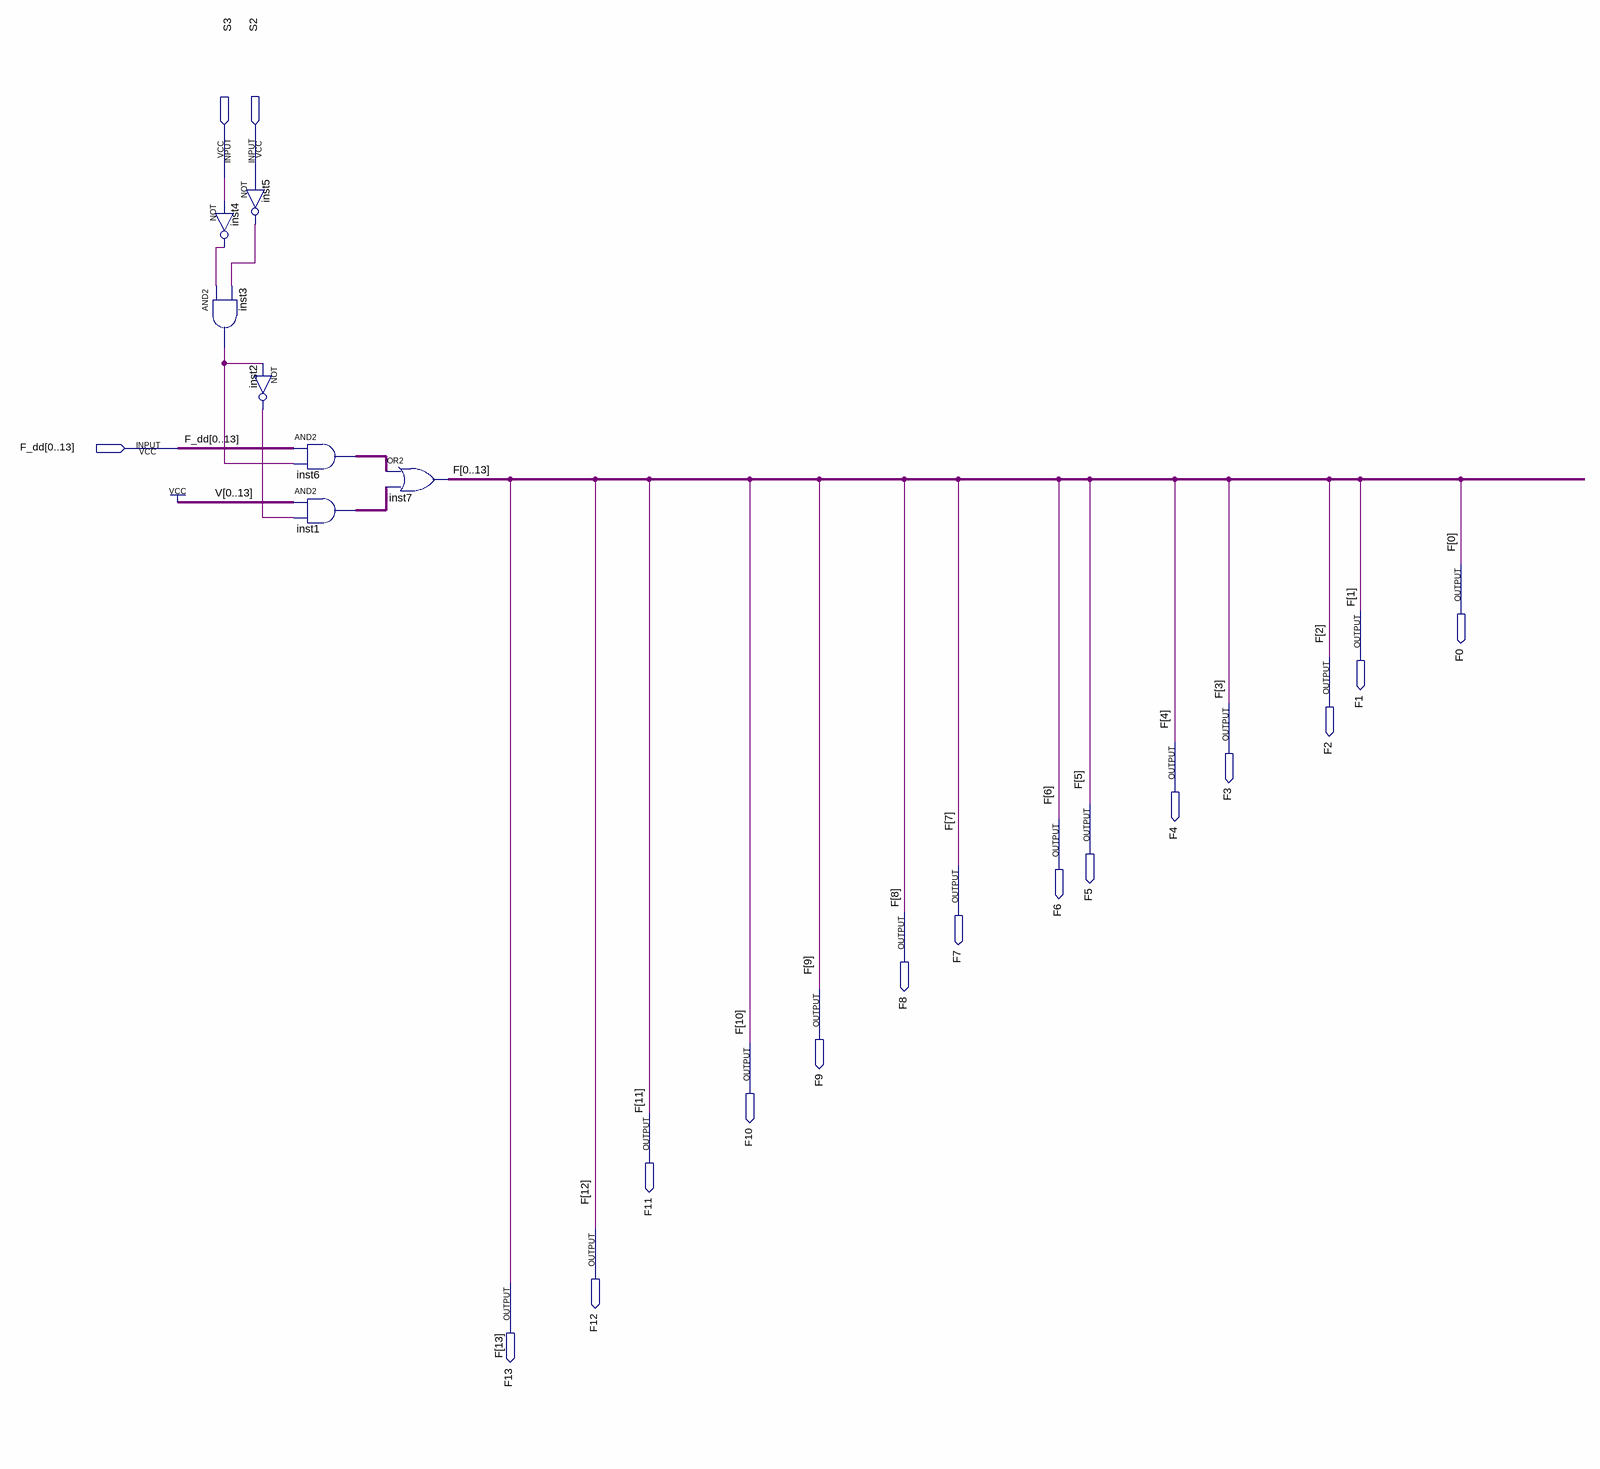
[diagram p0: schematic sheet]
// Quartus schematic MUX_d.bdf as structural Verilog: 7 symbols, 17 pins
module MUX_d (
  input  S3,
  input  S2,
  input  [0:13] F_dd,
  output F0,
  output F1,
  output F2,
  output F3,
  output F4,
  output F5,
  output F6,
  output F7,
  output F8,
  output F9,
  output F10,
  output F11,
  output F12,
  output F13
);

  wire inst2_out, inst3_out, inst4_out, inst5_out;
  wire [13:0] inst1_out, inst6_out;

  not inst4 (inst4_out, S3);
  and inst3 (inst3_out, inst4_out, inst5_out);
  not inst5 (inst5_out, S2);
  not inst2 (inst2_out, inst3_out);
  assign inst6_out = F_dd & {14{inst3_out}};  // AND2 inst6, 14 bits wide
  assign inst1_out = {14{1'b1}} & {14{inst2_out}};  // AND2 inst1, 14 bits wide
  assign {F0, F1, F2, F3, F4, F5, F6, F7, F8, F9, F10, F11, F12, F13} = inst6_out | inst1_out;  // OR2 inst7, 14 bits wide
endmodule
